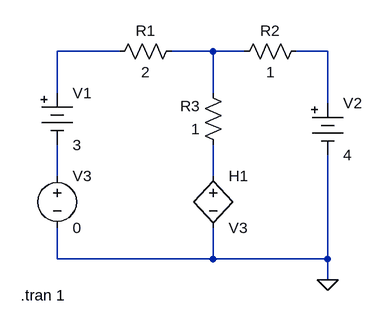
[diagram p0: schematic g3_p10.asc]
g3_p10.asc, the LTspice schematic file:
Version 4
SHEET 1 880 680
WIRE 48 128 -48 128
WIRE 192 128 128 128
WIRE 240 128 192 128
WIRE 368 128 320 128
WIRE -48 192 -48 128
WIRE 192 192 192 128
WIRE 368 208 368 128
WIRE -48 320 -48 272
WIRE 192 320 192 272
WIRE -48 448 -48 400
WIRE 192 448 192 400
WIRE 192 448 -48 448
WIRE 368 448 368 288
WIRE 368 448 192 448
WIRE 368 480 368 448
FLAG 368 480 0
SYMBOL res 144 112 R90
WINDOW 0 0 56 VBottom 2
WINDOW 3 32 56 VTop 2
SYMATTR InstName R1
SYMATTR Value 2
SYMBOL res 336 112 R90
WINDOW 0 0 56 VBottom 2
WINDOW 3 32 56 VTop 2
SYMATTR InstName R2
SYMATTR Value 1
SYMBOL res 208 288 R180
WINDOW 0 36 76 Left 2
WINDOW 3 36 40 Left 2
SYMATTR InstName R3
SYMATTR Value 1
SYMBOL h 192 304 R0
SYMATTR InstName H1
SYMATTR Value V3
SYMATTR Value2 3
SYMBOL Misc\\battery -48 176 R0
SYMATTR InstName V1
SYMATTR Value 3
SYMBOL Misc\\battery 368 192 R0
SYMATTR InstName V2
SYMATTR Value 4
SYMBOL voltage -48 304 R0
SYMATTR InstName V3
SYMATTR Value 0
TEXT -104 504 Left 2 !.tran 1

The netlist it stands for:
* g3_p10.asc
R1 N002 N001 2
R2 N003 N002 1
R3 N005 N002 1
H1 N005 0 V3 3
V1 N001 N004 3
V2 N003 0 4
V3 N004 0 0
.tran 1
.backanno
.end